# EAGLE design ArduinoInterface_v4.2 (EAGLE 9.2.1)
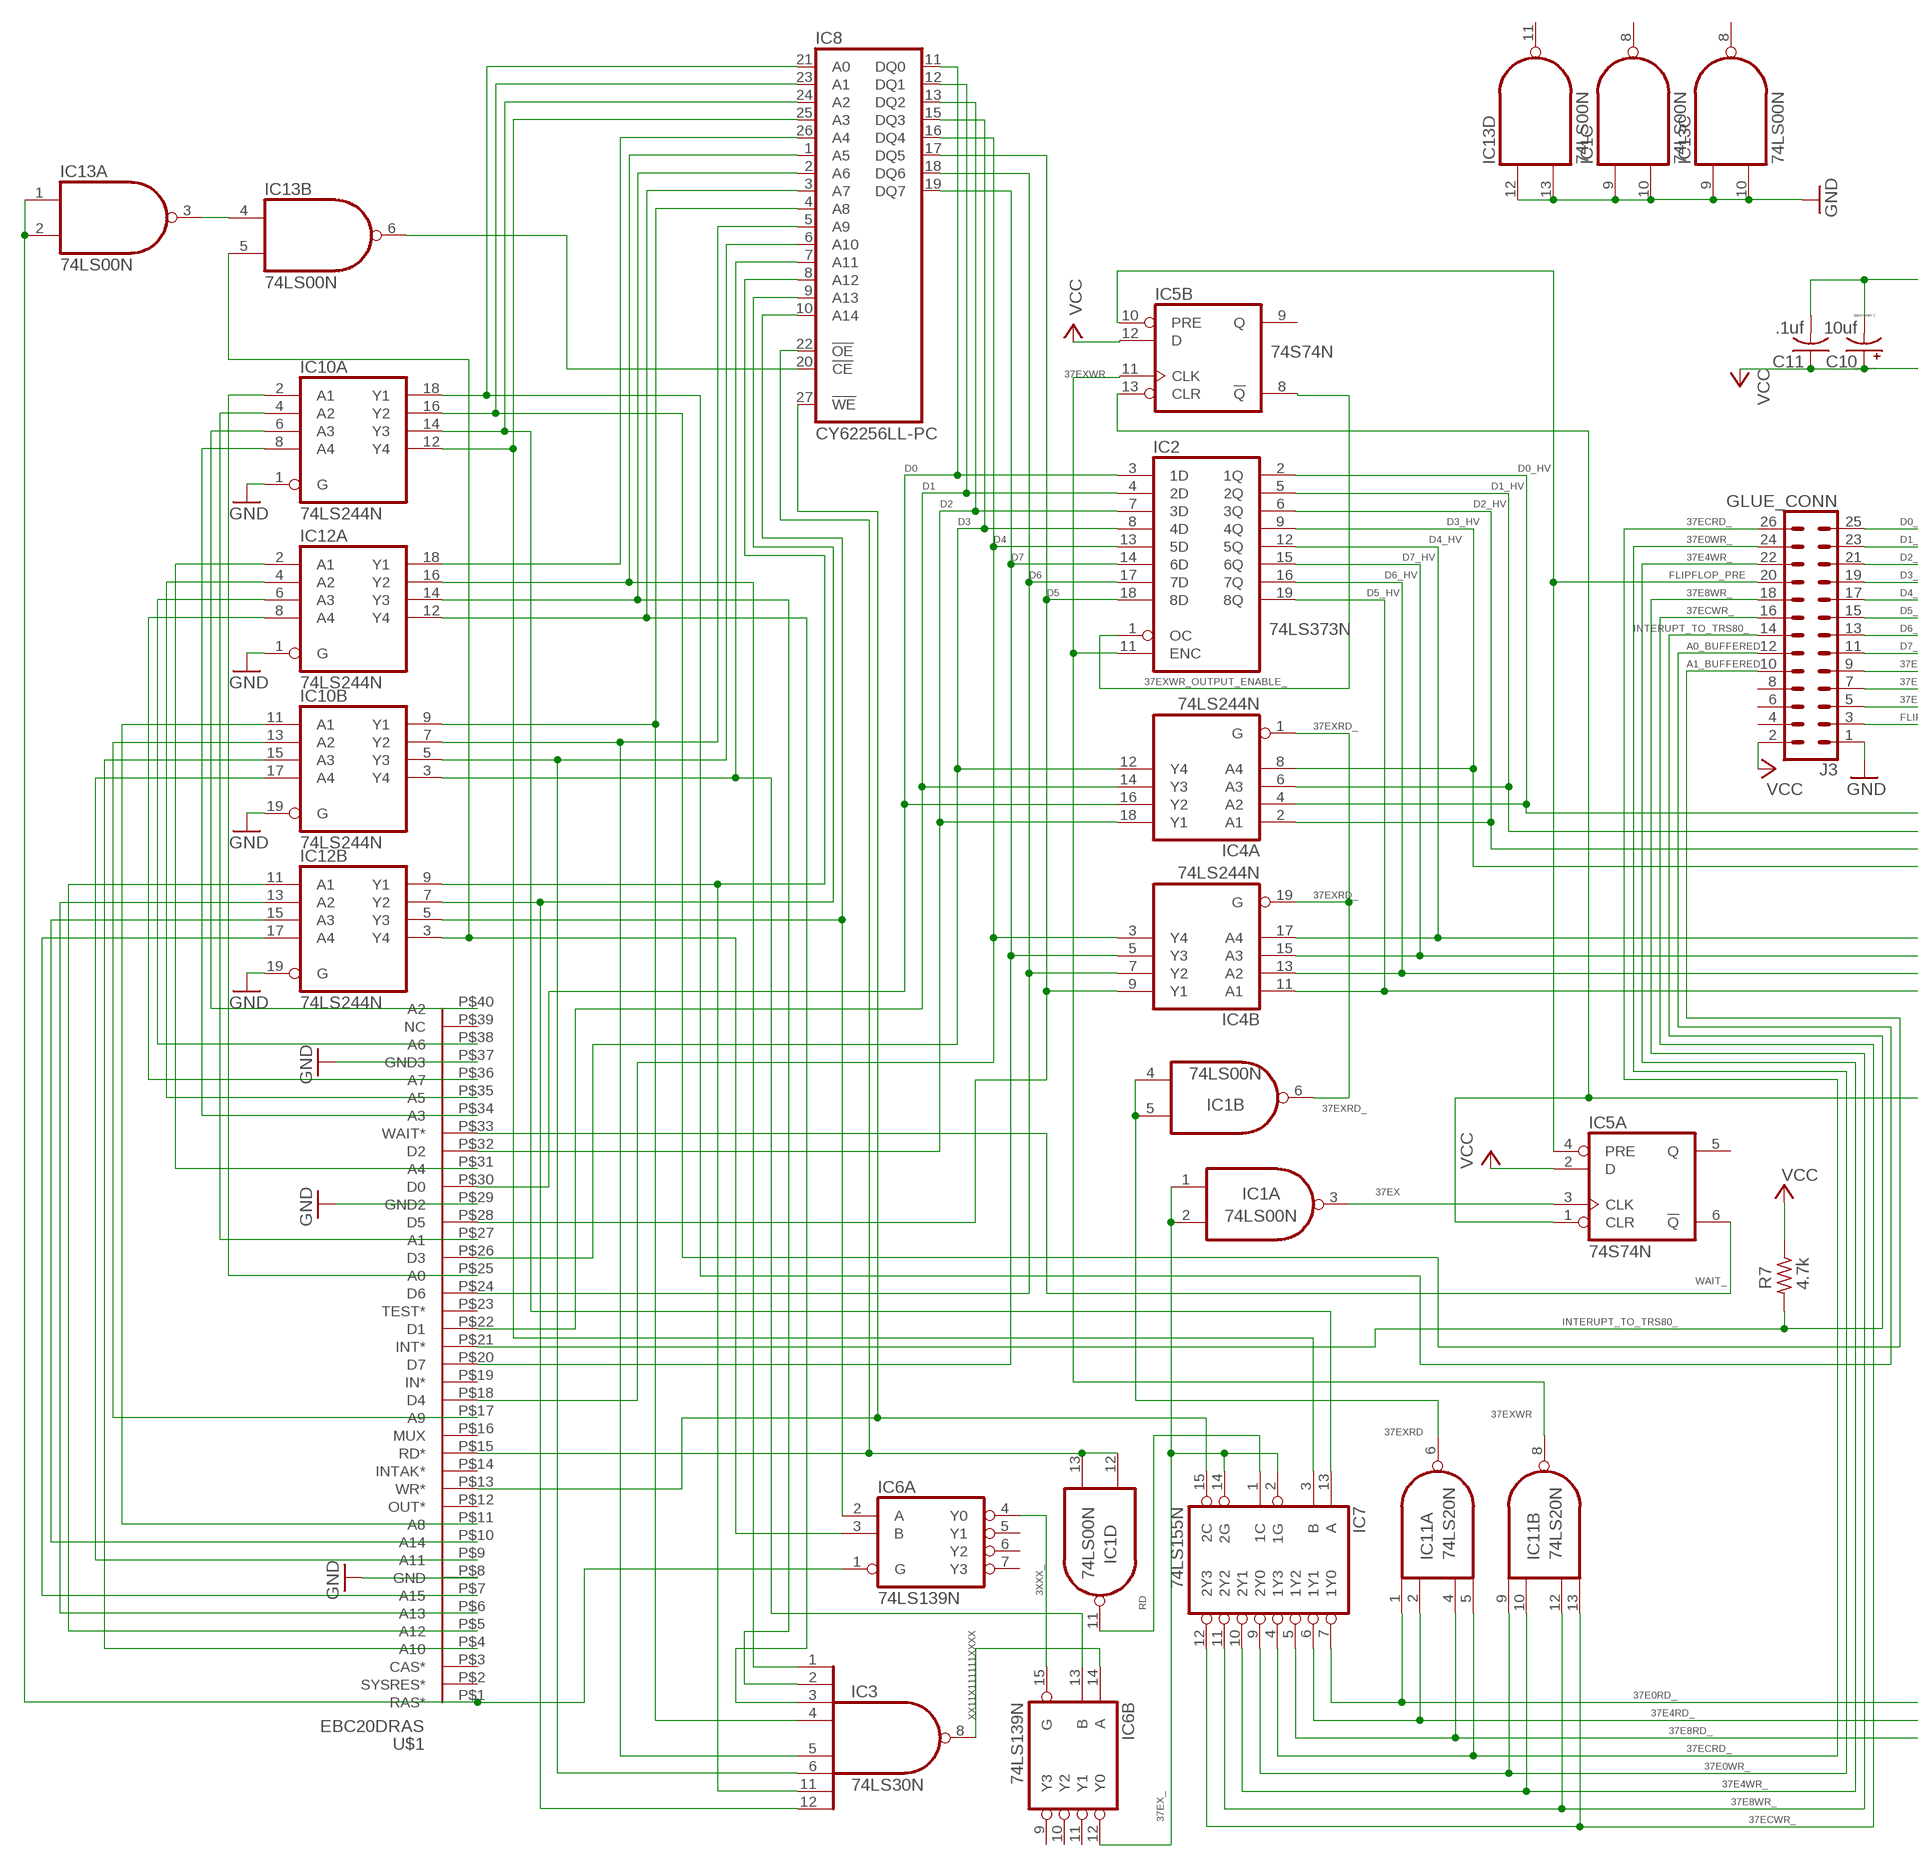
[diagram p0: schematic, sheet 1, part 1 of 2]
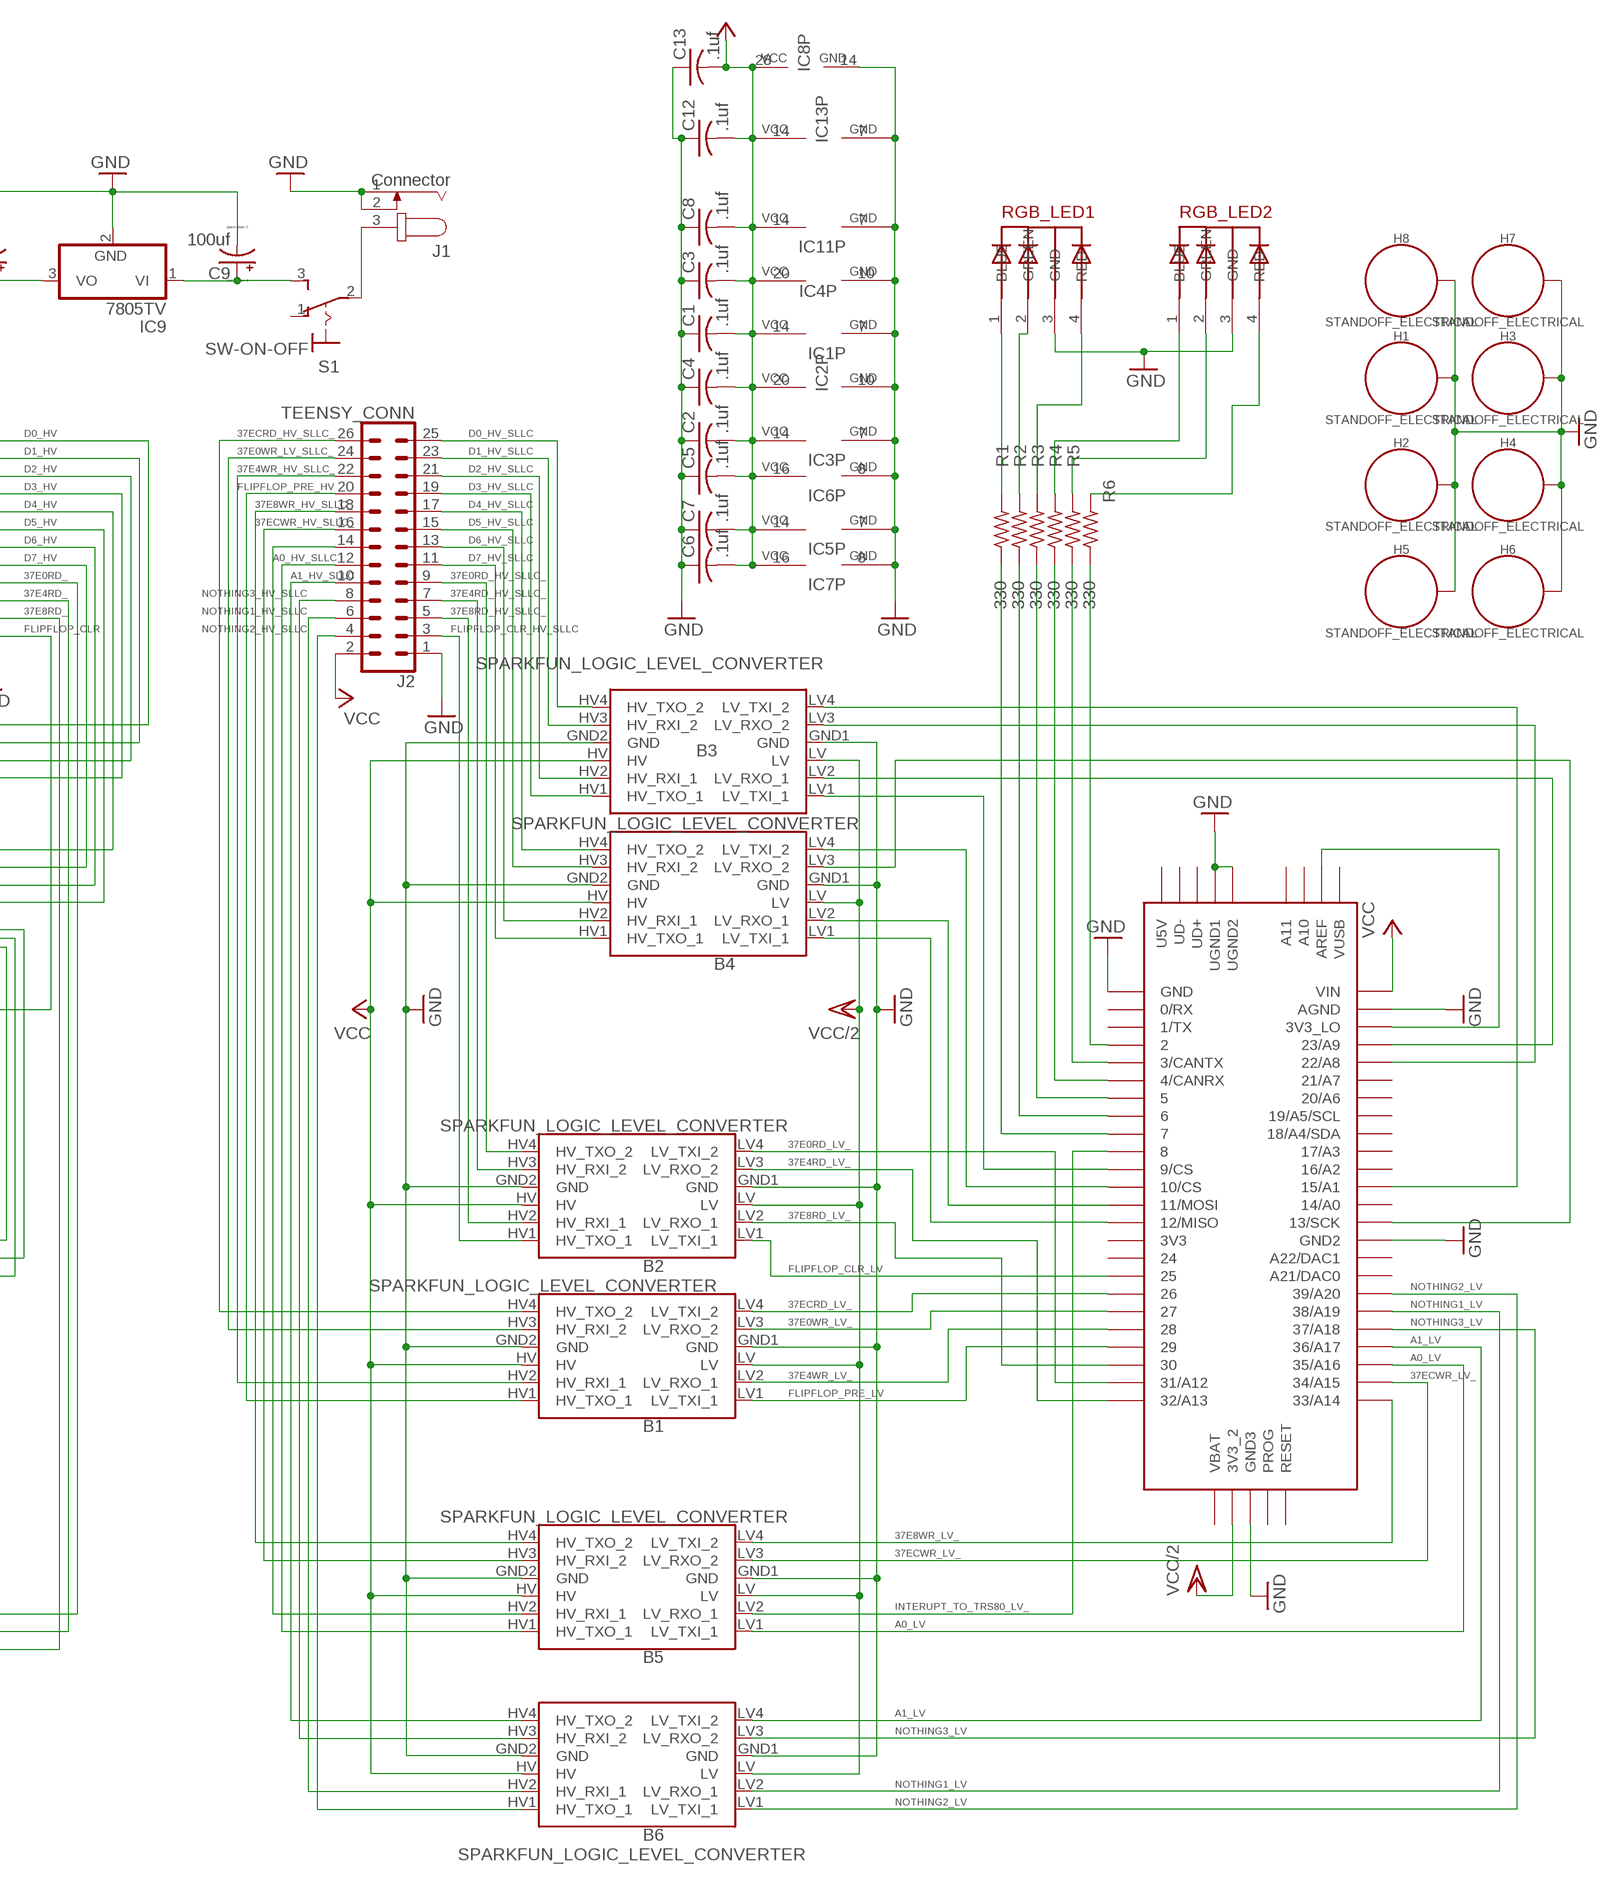
[diagram p1: schematic, sheet 1, part 2 of 2]

## Parts
B1  SPARKFUN_LOGIC_LEVEL_CONVERTER  [SPARKFUN_LOGIC_LEVEL_CONVERTER]
B2  SPARKFUN_LOGIC_LEVEL_CONVERTER  [SPARKFUN_LOGIC_LEVEL_CONVERTER]
B3  SPARKFUN_LOGIC_LEVEL_CONVERTER  [SPARKFUN_LOGIC_LEVEL_CONVERTER]
B4  SPARKFUN_LOGIC_LEVEL_CONVERTER  [SPARKFUN_LOGIC_LEVEL_CONVERTER]
B5  SPARKFUN_LOGIC_LEVEL_CONVERTER  [SPARKFUN_LOGIC_LEVEL_CONVERTER]
B6  SPARKFUN_LOGIC_LEVEL_CONVERTER  [SPARKFUN_LOGIC_LEVEL_CONVERTER]
C1  .1uf  C-US025-025X050  [C025-025X050]
C2  .1uf  C-US025-025X050  [C025-025X050]
C3  .1uf  C-US025-025X050  [C025-025X050]
C4  .1uf  C-US025-025X050  [C025-025X050]
C5  .1uf  C-US025-025X050  [C025-025X050]
C6  .1uf  C-US025-025X050  [C025-025X050]
C7  .1uf  C-US025-025X050  [C025-025X050]
C8  .1uf  C-US025-025X050  [C025-025X050]
C9  100uf  CPOL-USE5-6  [E5-6]
C10  10uf  CPOL-USE5-6  [E5-6]
C11  .1uf  C-US025-025X050  [C025-025X050]
C12  .1uf  C-US025-025X050  [C025-025X050]
C13  .1uf  C-US025-025X050  [C025-025X050]
H1  STANDOFF_ELECTRICAL  [STANDOFF-ELECTRICAL]
H2  STANDOFF_ELECTRICAL  [STANDOFF-ELECTRICAL]
H3  STANDOFF_ELECTRICAL  [STANDOFF-ELECTRICAL]
H4  STANDOFF_ELECTRICAL  [STANDOFF-ELECTRICAL]
H5  STANDOFF_ELECTRICAL  [STANDOFF-ELECTRICAL]
H6  STANDOFF_ELECTRICAL  [STANDOFF-ELECTRICAL]
H7  STANDOFF_ELECTRICAL  [STANDOFF-ELECTRICAL]
H8  STANDOFF_ELECTRICAL  [STANDOFF-ELECTRICAL]
IC1  74LS00N  [DIL14]
IC2  74LS373N  [DIL20]
IC3  74LS30N  [DIL14]
IC4  74LS244N  [DIL20]
IC5  74S74N  [DIL14]
IC6  74LS139N  [DIL16]
IC7  74LS155N  [DIL16]
IC8  CY62256LL-PC  [DIL28-6]
IC9  7805TV  [TO220V]
IC10  74LS244N  [DIL20]
IC11  74LS20N  [DIL14]
IC12  74LS244N  [DIL20]
IC13  74LS00N  [DIL14]
J1  Connector  JACK-PLUG0  [SPC4077]
J2  TEENSY_CONN  CONN_13X22X13  [2X13]
J3  GLUE_CONN  CONN_13X22X13  [2X13]
R1  330  R-US_0204/2V  [0204V]
R2  330  R-US_0204/2V  [0204V]
R3  330  R-US_0204/2V  [0204V]
R4  330  R-US_0204/2V  [0204V]
R5  330  R-US_0204/2V  [0204V]
R6  330  R-US_0204/2V  [0204V]
R7  4.7k  R-US_0204/2V  [0204V]
RGB_LED1  5MMRGBLED  [LED5MMRGB]
RGB_LED2  5MMRGBLED  [LED5MMRGB]
S1  SW-ON-OFF  M9040P  [M9040P]
U$1  EBC20DRAS  [EBC20DRAS]
U$2  TEENSY_3.5/3.6  [TEENSY_3.5/3.6]

## Nets
3XXX_: IC6.4(A:Y0) IC6.15(B:G)
9V: C9.+ IC9.1(VI) S1.3(S)
9V_TO_SW: J1.3 S1.2(P)
37E0RD_: IC7.7(1Y0) IC11.1(A:I0) J3.9
37E0RD_HV_SLLC_: B2.HV4(HV_TXO_2) J2.9
37E0RD_LV_: B2.LV4(LV_TXI_2) U$2.31/A12
37E0WR_: IC7.9(2Y0) IC11.9(B:I0) J3.24
37E0WR_LV_: B1.LV3(LV_RXO_2) U$2.27
37E0WR_LV_SLLC_: B1.HV3(HV_RXI_2) J2.24
37E4RD_: IC7.6(1Y1) IC11.2(A:I1) J3.7
37E4RD_HV_SLLC_: B2.HV3(HV_RXI_2) J2.7
37E4RD_LV_: B2.LV3(LV_RXO_2) U$2.32/A13
37E4WR_: IC7.10(2Y1) IC11.10(B:I1) J3.22
37E4WR_HV_SLLC_: B1.HV2(HV_RXI_1) J2.22
37E4WR_LV_: B1.LV2(LV_RXO_1) U$2.28
37E8RD_: IC7.5(1Y2) IC11.4(A:I2) J3.5
37E8RD_HV_SLLC_: B2.HV2(HV_RXI_1) J2.5
37E8RD_LV_: B2.LV2(LV_RXO_1) U$2.30
37E8WR_: IC7.11(2Y2) IC11.12(B:I2) J3.18
37E8WR_HV_SLLC_: B5.HV4(HV_TXO_2) J2.18
37E8WR_LV_: B5.LV4(LV_TXI_2) U$2.33/A14
37ECRD_: IC7.4(1Y3) IC11.5(A:I3) J3.26
37ECRD_HV_SLLC_: B1.HV4(HV_TXO_2) J2.26
37ECRD_LV_: B1.LV4(LV_TXI_2) U$2.26
37ECWR_: IC7.12(2Y3) IC11.13(B:I3) J3.16
37ECWR_HV_SLLC_: B5.HV3(HV_RXI_2) J2.16
37ECWR_LV_: B5.LV3(LV_RXO_2) U$2.34/A15
37EX: IC1.3(A:O) IC5.3(A:CLK)
37EX_: IC1.1(A:I0) IC1.2(A:I1) IC6.12(B:Y0) IC7.2(1G) IC7.14(2G)
37EXRD: IC1.4(B:I0) IC1.5(B:I1) IC11.6(A:O)
37EXRD_: IC1.6(B:O) IC4.1(A:G) IC4.19(B:G)
37EXWR: IC2.11(ENC) IC5.11(B:CLK) IC11.8(B:O)
37EXWR_OUTPUT_ENABLE_: IC2.1(OC) IC5.8(B:!Q)
A0_BUFFERED: IC8.21(A0) IC10.18(A:Y1) J3.12
A0_HV_SLLC: B5.HV1(HV_TXO_1) J2.12
A0_LV: B5.LV1(LV_TXI_1) U$2.35/A16
A0_RAW: IC10.2(A:A1) U$1.P$25(A0)
A1_BUFFERED: IC8.23(A1) IC10.16(A:Y2) J3.10
A1_HV_SLLC: B6.HV4(HV_TXO_2) J2.10
A1_LV: B6.LV4(LV_TXI_2) U$2.36/A17
A1_RAW: IC10.4(A:A2) U$1.P$27(A1)
A2_BUFFERED: IC7.13(A) IC8.24(A2) IC10.14(A:Y3)
A2_RAW: IC10.6(A:A3) U$1.P$40(A2)
A3_BUFFERED: IC7.3(B) IC8.25(A3) IC10.12(A:Y4)
A3_RAW: IC10.8(A:A4) U$1.P$34(A3)
A4_RAW: IC12.2(A:A1) U$1.P$31(A4)
A5_BUFFERED: IC3.1(I0) IC8.1(A5) IC12.16(A:Y2)
A5_RAW: IC12.4(A:A2) U$1.P$35(A5)
A6_BUFFERED: IC3.2(I1) IC8.2(A6) IC12.14(A:Y3)
A6_RAW: IC12.6(A:A3) U$1.P$38(A6)
A7_BUFFERED: IC3.3(I2) IC8.3(A7) IC12.12(A:Y4)
A7_RAW: IC12.8(A:A4) U$1.P$36(A7)
A8_BUFFERED: IC3.4(I3) IC8.4(A8) IC10.9(B:Y1)
A8_RAW: IC10.11(B:A1) U$1.P$11(A8)
A9_BUFFERED: IC3.5(I4) IC8.5(A9) IC10.7(B:Y2)
A9_RAW: IC10.13(B:A2) U$1.P$17(A9)
A10_BUFFERED: IC3.6(I5) IC8.6(A10) IC10.5(B:Y3)
A10_RAW: IC10.15(B:A3) U$1.P$4(A10)
A11_BUFFERED: IC6.13(B:B) IC8.7(A11) IC10.3(B:Y4)
A11_RAW: IC10.17(B:A4) U$1.P$9(A11)
A12_BUFFERED: IC3.11(I6) IC8.8(A12) IC12.9(B:Y1)
A12_RAW: IC12.11(B:A1) U$1.P$5(A12)
A13_BUFFERED: IC3.12(I7) IC8.9(A13) IC12.7(B:Y2)
A13_RAW: IC12.13(B:A2) U$1.P$6(A13)
A14_BUFFERED: IC6.2(A:A) IC8.10(A14) IC12.5(B:Y3)
A14_RAW: IC12.15(B:A3) U$1.P$10(A14)
A15_BUFFERED: IC6.3(A:B) IC12.3(B:Y4) IC13.5(B:I1)
A15_RAW: IC12.17(B:A4) U$1.P$7(A15)
D0: IC2.3(1D) IC4.16(A:Y2) IC8.11(DQ0) U$1.P$30(D0)
D0_HV: IC2.2(1Q) IC4.4(A:A2) J3.25
D0_HV_SLLC: B3.HV4(HV_TXO_2) J2.25
D0_LV: B3.LV4(LV_TXI_2) U$2.15/A1
D1: IC2.4(2D) IC4.14(A:Y3) IC8.12(DQ1) U$1.P$22(D1)
D1_HV: IC2.5(2Q) IC4.6(A:A3) J3.23
D1_HV_SLLC: B3.HV3(HV_RXI_2) J2.23
D1_LV: B3.LV3(LV_RXO_2) U$2.22/A8
D2: IC2.7(3D) IC4.18(A:Y1) IC8.13(DQ2) U$1.P$32(D2)
D2_HV: IC2.6(3Q) IC4.2(A:A1) J3.21
D2_HV_SLLC: B3.HV2(HV_RXI_1) J2.21
D2_LV: B3.LV2(LV_RXO_1) U$2.23/A9
D3: IC2.8(4D) IC4.12(A:Y4) IC8.15(DQ3) U$1.P$26(D3)
D3_HV: IC2.9(4Q) IC4.8(A:A4) J3.19
D3_HV_SLLC: B3.HV1(HV_TXO_1) J2.19
D3_LV: B3.LV1(LV_TXI_1) U$2.9/CS
D4: IC2.13(5D) IC4.3(B:Y4) IC8.16(DQ4) U$1.P$18(D4)
D4_HV: IC2.12(5Q) IC4.17(B:A4) J3.17
D4_HV_SLLC: B4.HV4(HV_TXO_2) J2.17
D4_LV: B4.LV4(LV_TXI_2) U$2.10/CS
D5: IC2.18(8D) IC4.9(B:Y1) IC8.17(DQ5) U$1.P$28(D5)
D5_HV: IC2.19(8Q) IC4.11(B:A1) J3.15
D5_HV_SLLC: B4.HV3(HV_RXI_2) J2.15
D5_LV: B4.LV3(LV_RXO_2) U$2.13/SCK
D6: IC2.17(7D) IC4.7(B:Y2) IC8.18(DQ6) U$1.P$24(D6)
D6_HV: IC2.16(7Q) IC4.13(B:A2) J3.13
D6_HV_SLLC: B4.HV2(HV_RXI_1) J2.13
D6_LV: B4.LV2(LV_RXO_1) U$2.11/MOSI
D7: IC2.14(6D) IC4.5(B:Y3) IC8.19(DQ7) U$1.P$20(D7)
D7_HV: IC2.15(6Q) IC4.15(B:A3) J3.11
D7_HV_SLLC: B4.HV1(HV_TXO_1) J2.11
D7_LV: B4.LV1(LV_TXI_1) U$2.12/MISO
FLIPFLOP_CLR: IC5.1(A:CLR) IC5.13(B:CLR) J3.3
FLIPFLOP_CLR_HV_SLLC: B2.HV1(HV_TXO_1) J2.3
FLIPFLOP_CLR_LV: B2.LV1(LV_TXI_1) U$2.25
FLIPFLOP_PRE: IC5.4(A:PRE) IC5.10(B:PRE) J3.20
FLIPFLOP_PRE_HV: B1.HV1(HV_TXO_1) J2.20
FLIPFLOP_PRE_LV: B1.LV1(LV_TXI_1) U$2.29
GND: B1.GND1(GND) B1.GND2(GND) B2.GND1(GND) B2.GND2(GND) B3.GND1(GND) B3.GND2(GND) B4.GND1(GND) B4.GND2(GND) B5.GND1(GND) B5.GND2(GND) B6.GND1(GND) B6.GND2(GND) C1.1 C2.1 C3.1 C4.1 C5.1 C6.1 C7.1 C8.1 C9.- C10.- C11.2 C12.1 C13.1 H1.P1 H2.P1 H3.P1 H4.P1 H5.P1 H6.P1 H7.P1 H8.P1 IC1.7(P:GND) IC1.9(C:I0) IC1.10(C:I1) IC2.10(GND) IC3.7(GND) IC4.10(P:GND) IC5.7(P:GND) IC6.8(P:GND) IC7.8(GND) IC8.14(GND) IC9.2(GND) IC10.1(A:G) IC10.19(B:G) IC11.7(P:GND) IC12.1(A:G) IC12.19(B:G) IC13.7(P:GND) IC13.9(C:I0) IC13.10(C:I1) IC13.12(D:I0) IC13.13(D:I1) J1.1 J1.2 J2.1 J3.1 RGB_LED1.3(GND) RGB_LED2.3(GND) U$1.P$8(GND) U$1.P$29(GND2) U$1.P$37(GND3) U$2.AGND U$2.GND U$2.GND2 U$2.GND3 U$2.UGND1 U$2.UGND2
INTERUPT_TO_TRS80_: J3.14 R7.2 U$1.P$21(INT*)
INTERUPT_TO_TRS80_HV_SLLC_: B5.HV2(HV_RXI_1) J2.14
INTERUPT_TO_TRS80_LV_: B5.LV2(LV_RXO_1) U$2.8
N$1: U$2.3V3_LO U$2.AREF
N$2: R2.2 RGB_LED1.2(GREEN)
N$3: R6.1 U$2.2
N$4: R5.1 U$2.3/CANTX
N$5: R4.1 U$2.4/CANRX
N$6: R3.1 U$2.5
N$7: R2.1 U$2.6
N$8: R1.1 U$2.7
N$9: IC8.26(A4) IC12.18(A:Y1)
N$10: R1.2 RGB_LED1.1(BLUE)
N$11: IC8.20(!CE) IC13.6(B:O)
N$15: R3.2 RGB_LED1.4(RED)
N$19: R4.2 RGB_LED2.1(BLUE)
N$20: R5.2 RGB_LED2.2(GREEN)
N$21: R6.2 RGB_LED2.4(RED)
NOTHING1_HV_SLLC: B6.HV2(HV_RXI_1) J2.6
NOTHING1_LV: B6.LV2(LV_RXO_1) U$2.38/A19
NOTHING2_HV_SLLC: B6.HV1(HV_TXO_1) J2.4
NOTHING2_LV: B6.LV1(LV_TXI_1) U$2.39/A20
NOTHING3_HV_SLLC: B6.HV3(HV_RXI_2) J2.8
NOTHING3_LV: B6.LV3(LV_RXO_2) U$2.37/A18
RAS: IC13.3(A:O) IC13.4(B:I0)
RAS_: IC6.1(A:G) IC13.1(A:I0) IC13.2(A:I1) U$1.P$1(RAS*)
RD: IC1.11(D:O) IC7.1(1C)
RD_: IC1.12(D:I0) IC1.13(D:I1) IC8.22(!OE) U$1.P$15(RD*)
VCC: B1.HV B2.HV B3.HV B4.HV B5.HV B6.HV C1.2 C2.2 C3.2 C4.2 C5.2 C6.2 C7.2 C8.2 C10.+ C11.1 C12.2 C13.2 IC1.14(P:VCC) IC2.20(VCC) IC3.14(VCC) IC4.20(P:VCC) IC5.2(A:D) IC5.12(B:D) IC5.14(P:VCC) IC6.16(P:VCC) IC7.16(VCC) IC8.28(VCC) IC9.3(VO) IC11.14(P:VCC) IC13.14(P:VCC) J2.2 J3.2 R7.1 U$2.VIN
VCC/2: B1.LV B2.LV B3.LV B4.LV B5.LV B6.LV U$2.3V3_2
WAIT_: IC5.6(A:!Q) U$1.P$33(WAIT*)
WR_: IC7.15(2C) IC8.27(!WE) U$1.P$13(WR*)
XX11X111111XXXX: IC3.8(O) IC6.14(B:A)
Unconnected: IC1.8(C:O) IC5.5(A:Q) IC5.9(B:Q) IC6.5(A:Y1) IC6.6(A:Y2) IC6.7(A:Y3) IC6.9(B:Y3) IC6.10(B:Y2) IC6.11(B:Y1) IC13.8(C:O) IC13.11(D:O) J3.4 J3.6 J3.8 S1.1(O) U$1.P$2(SYSRES*) U$1.P$3(CAS*) U$1.P$12(OUT*) U$1.P$14(INTAK*) U$1.P$16(MUX) U$1.P$19(IN*) U$1.P$23(TEST*) U$1.P$39(NC) U$2.0/RX U$2.1/TX U$2.3V3 U$2.14/A0 U$2.16/A2 U$2.17/A3 U$2.18/A4/SDA U$2.19/A5/SCL U$2.20/A6 U$2.21/A7 U$2.21/DAC0(A21/DAC0) U$2.24 U$2.A10 U$2.A11 U$2.A22/DAC1 U$2.PROG U$2.RESET U$2.U5V U$2.UD+ U$2.UD- U$2.VBAT U$2.VUSB

## Power pins joined to a net without a drawn wire
GND: IC10.10(P:GND) IC12.10(P:GND)
VCC: IC10.20(P:VCC) IC12.20(P:VCC)

## Library data of the parts
B1-B6 = SparkFun-Boards:SPARKFUN_LOGIC_LEVEL_CONVERTER: SparkFun Logic Level Converter -Bi-Directional This is the mechnical outline for the 3.3V - 5V bi directional logic level converter. *Note, the "LOCK" Package has the header pins staggered by an offset of 5 mils (off center line), so that when you slide a row of standard 0.1" headers into the PTH pads, it will hold position vertically. See the follwing turorial for more information on this type of special footprints: Sneaky Footprints <https://www.sparkfun.com/tutorials/114> SparkFun Products: SparkFun Logic Level Converter - Bi-Directional <https://www.sparkfun.com/products/12009>
C1-C8 C11-C13 = adafruit:C-US: CAPACITOR, American symbol
C9 C10 = resistor:CPOL-US: POLARIZED CAPACITOR, American symbol
H1-H8 = SparkFun-Hardware:STANDOFF_ELECTRICAL: Stand Off Drill holes with an electrical connection. For example, use these to ground your board to a chassis. Example SparkFun Products Screw - Phillips Head (1/4", 4-40, 10 pack) <https://www.sparkfun.com/products/10453> (PRT-10453) Screw - Phillips Head (1/2", 4-40, 10 pack) <https://www.sparkfun.com/products/10452> (PRT-10452) Screw - Phillips Head (3/4", 4-40, 10 pack) <https://www.sparkfun.com/products/10451> (PRT-10451) Screw - Phillips Head (1", 4-40, 10 pack) <https://www.sparkfun.com/products/10450> (PRT-10450)
IC1 IC13 = 74xx-us:74*00: Quad 2-input NAND gate
IC2 = 74xx-us:74*373: Octal D type transparent LATCH, edge triggered
IC3 = 74xx-us:74*30: 8-input NAND gate
IC4 IC10 IC12 = 74xx-us:74*244: Octal BUFFER and LINE DRIVER, 3-state
IC5 = 74xx-us:74*74: Dual D type positive edge triggered FLIP FLOP, preset and clear
IC6 = 74xx-us:74*139: Dual 2-line to 4-line DECODER/DEMULTIPLEXER
IC7 = 74xx-us:74*155: Dual 2-line to 4-line data DECODER/DEMULTIPLEXER
IC8 = memory-sram:CY62256LL-?*: 256K (32K x 8) CMOS-Static RAM Source: http://download.cypress.com.edgesuite.net/design_resources/datasheets/contents/cy62256_8.pdf
IC9 = linear:78*: Positive VOLTAGE REGULATOR Source: http://cache.national.com/ds/LM/LM78L05.pdf http://www.fairchildsemi.com/ds/LM/LM7805.pdf
IC11 = 74xx-us:74*20: Dual 4-input NAND gate
J1 = con-jack:JACK-PLUG: DC POWER JACK Power Jack, DC, Right Angle, Through Hole, Rated 5A at 16VDC, PC Terminals Distributor: Farnell (www.Farnell.de) Drawing: 84N1161.pdf / 84N1162.pdf Manufacturer: SPC Technology (www.spctechnology.com) Type: SPC4077 / SPC 4078; OC_FARNELL: unknown; OC_NEWARK: unknown
J2 J3 = SparkFun-Connectors:CONN_13X2: Multi connection point. Often used as Generic Header-pin footprint for 0.1 inch spaced/style header connections On any of the 0.1 inch spaced packages, you can populate with these: Break Away Headers - Straight <https://www.sparkfun.com/products/116> (PRT-00116) Break Away Male Headers - Right Angle <https://www.sparkfun.com/products/553> (PRT-00553) Female Headers <https://www.sparkfun.com/products/115> (PRT-00115) Break Away Headers - Machine Pin <https://www.sparkfun.com/products/117> (PRT-00117) Break Away Female Headers - Swiss Machine Pin <https://www.sparkfun.com/products/743> (PRT-00743)
R1-R7 = resistor:R-US_: RESISTOR, American symbol
RGB_LED1 RGB_LED2 = adafruit:5MMRGBLED
S1 = switch:M9040P: TOGGLE SWITCH Marquardt
U$1 = TMS99:EBC20DRAS
U$2 = Teensy356:TEENSY_3.5/3.6

## Net classes
0 default: width 0.3 mm, clearance 0.05 mm

## Board
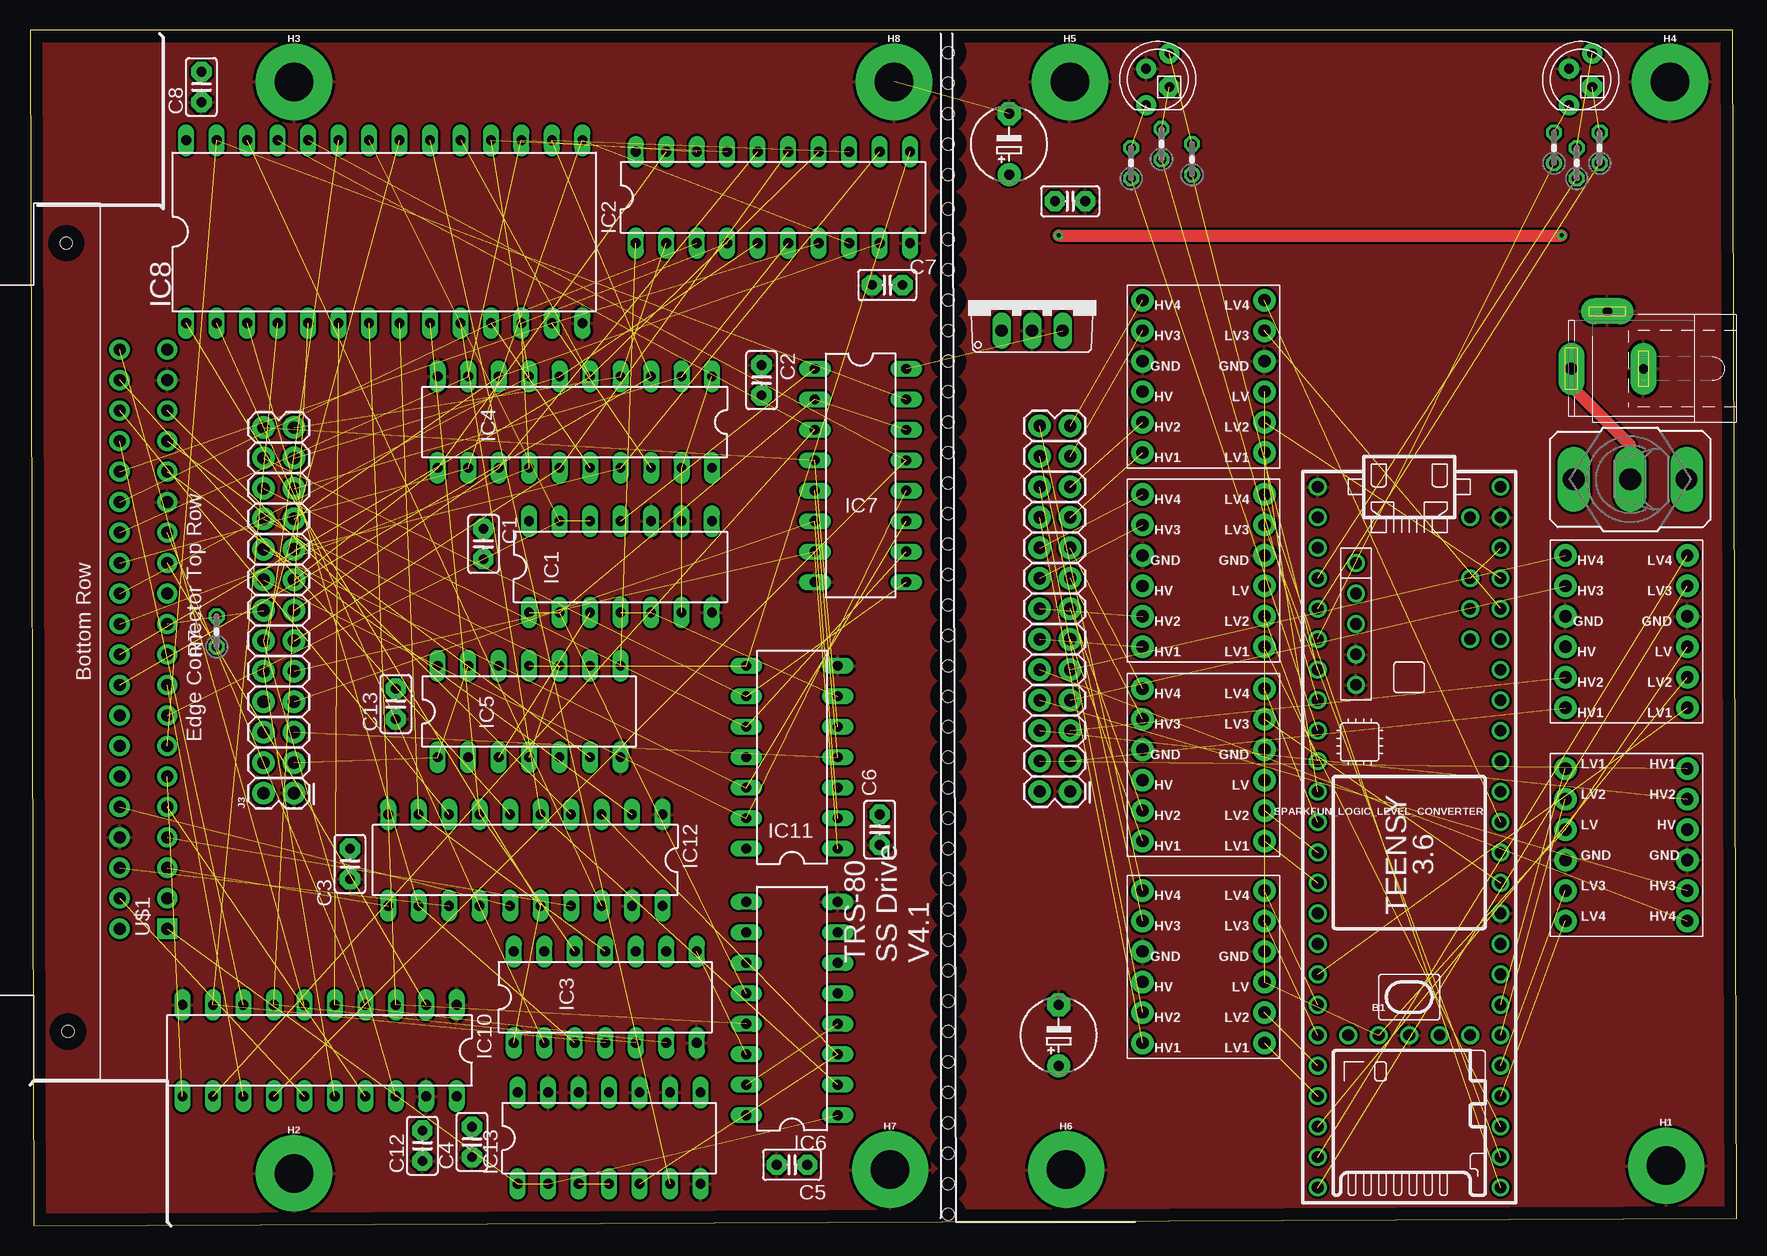
[diagram p2: board, top side]
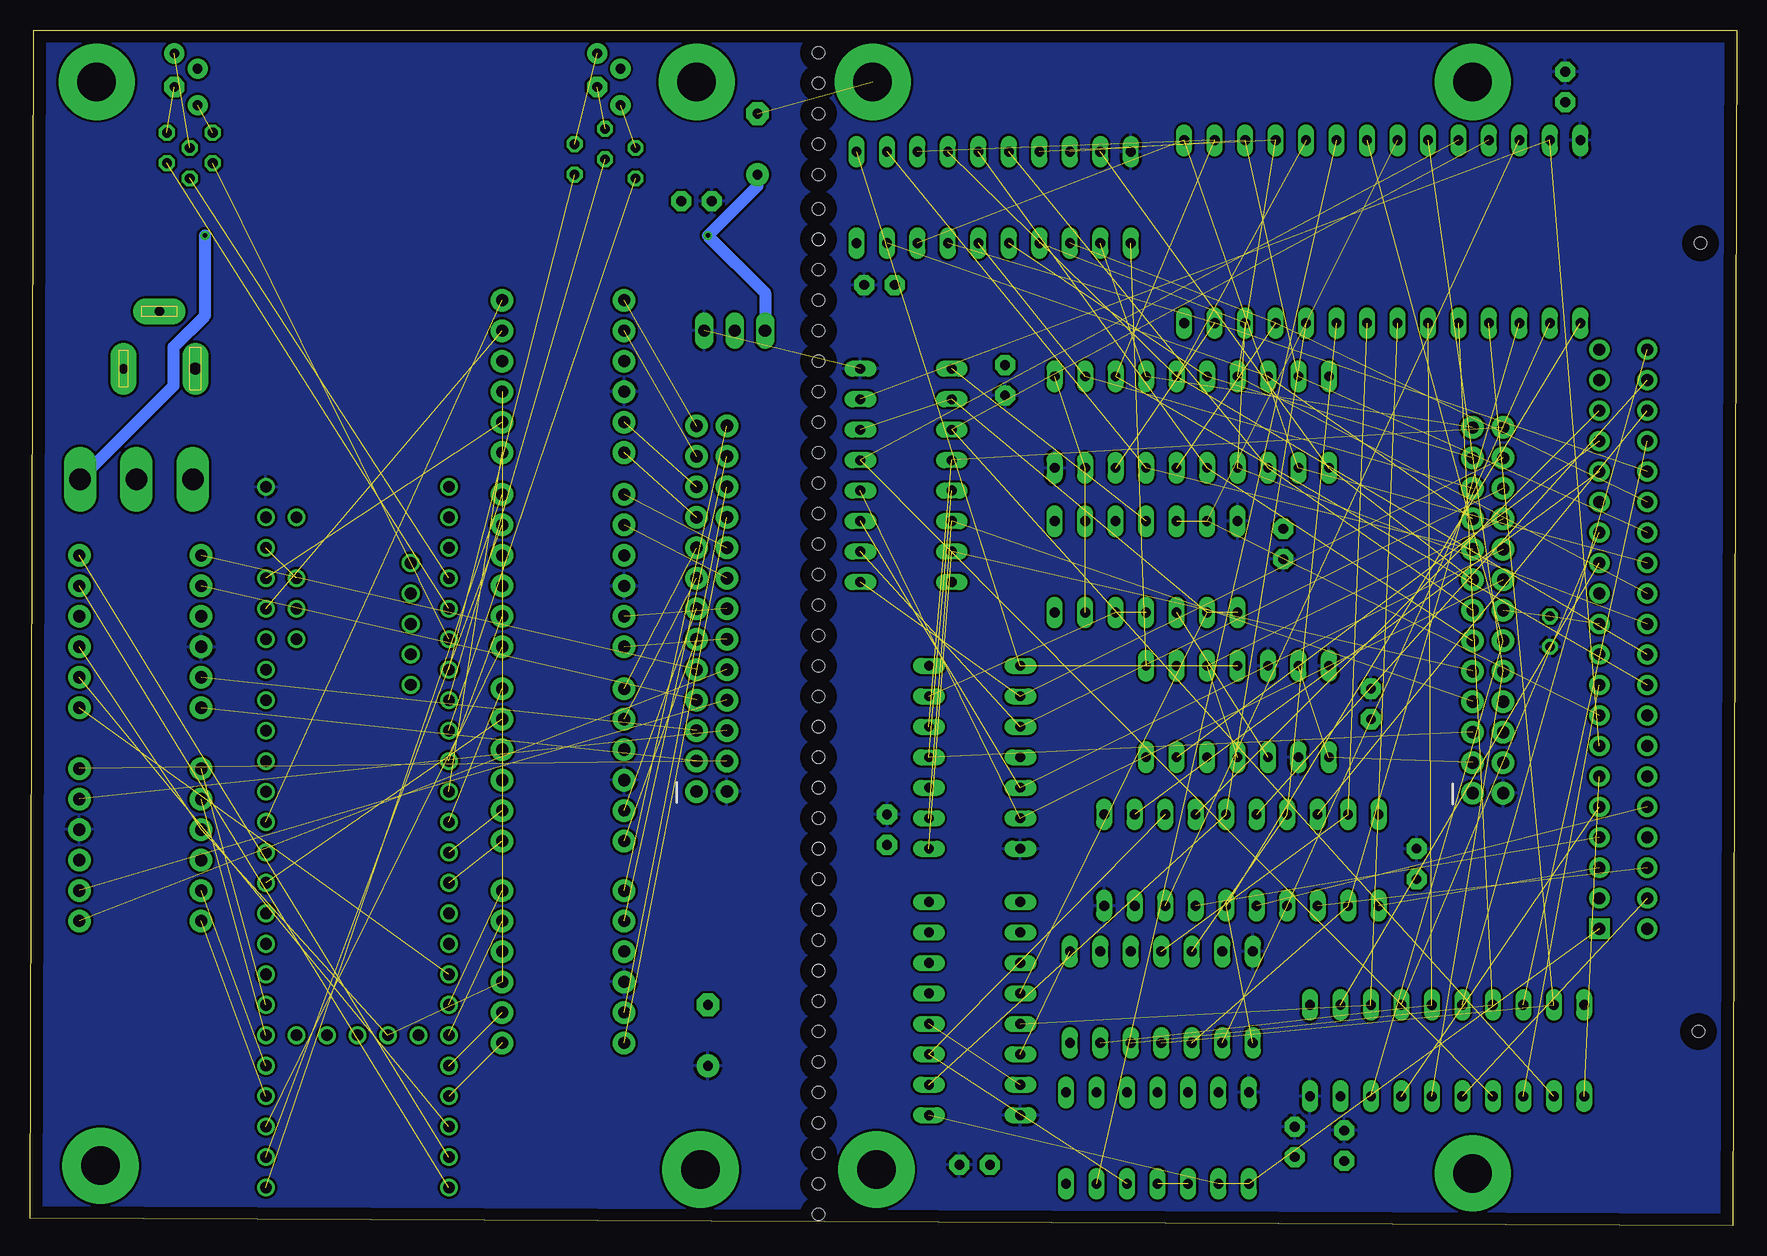
[diagram p3: board, bottom side, seen from below]

Size 142.22 x 99.68 mm. Coordinates in mm from the lower left corner, seen from the top.
Outline: 0.32,0 142.22,0.63 141.9,99.68 0,99.68 0.32,0
Copper layers (1*16): Top 0.035mm / dielectric 1.5mm / Bottom 0.035mm
Design rules "default": minimum track width 0.2mm, minimum drill 0.35mm, track to track 8mil, track to pad 8mil, pad to pad 8mil, via to via 8mil, smd to smd 8mil, copper to edge 40mil, drill to drill 6mil, minimum pad ring 10mil, minimum via ring 8mil, stop-mask expansion 4mil, vias tented up to drill 0mil, thermal gap 10mil
Holes 1 mm at 76.52,84.77 76.52,79.69 76.52,74.61 76.52,69.53 76.52,64.45 76.52,61.91 76.52,59.37 76.52,54.29 76.52,51.75 76.52,44.13 76.52,41.59 76.52,39.05 76.52,33.97 76.52,31.43 76.52,28.89 76.52,23.81 76.52,18.73 76.52,13.65 76.52,56.83 76.52,66.99 76.52,49.21 76.52,21.27 76.52,77.15 76.52,36.51 76.52,87.63 76.52,90.17 76.52,92.71 76.52,11.11 76.52,8.57 76.52,6.03 76.52,3.49 76.52,95.25 76.52,97.79 76.52,82.23 76.52,72.07 76.52,46.67 76.52,26.35 76.52,16.19 76.52,0.95

### Footprints (pad centres in the part's own frame; a part is rotated, then mirrored left to right if it is on the bottom)
SPARKFUN_LOGIC_LEVEL_CONVERTER = drill 1.016 pad 1.88: GND1 -5.08,-1.27; GND2 5.08,-1.27; HV 5.08,1.27; HV1 5.08,6.35; HV2 5.08,3.81; HV3 5.08,-3.81; HV4 5.08,-6.35; LV -5.08,1.27; LV1 -5.08,6.35; LV2 -5.08,3.81; LV3 -5.08,-3.81; LV4 -5.08,-6.35
C025-025X050 = drill 0.813 pad 1.676 octagon: 1 -1.27,0; 2 1.27,0
E5-6 = drill 0.813 pad 1.905: + -2.54,0 | drill 0.813 pad 1.905 octagon: - 2.54,0
STANDOFF-ELECTRICAL = drill 3.2 pad 6.35: P1 0,0
DIL14 = drill 0.813 long: 1 -7.62,-3.81; 2 -5.08,-3.81; 3 -2.54,-3.81; 4 0,-3.81; 5 2.54,-3.81; 6 5.08,-3.81; 7 7.62,-3.81; 8 7.62,3.81; 9 5.08,3.81; 10 2.54,3.81; 11 0,3.81; 12 -2.54,3.81; 13 -5.08,3.81; 14 -7.62,3.81
DIL20 = drill 0.813 long: 1 -11.43,-3.81; 2 -8.89,-3.81; 3 -6.35,-3.81; 4 -3.81,-3.81; 5 -1.27,-3.81; 6 1.27,-3.81; 7 3.81,-3.81; 8 6.35,-3.81; 9 8.89,-3.81; 10 11.43,-3.81; 11 11.43,3.81; 12 8.89,3.81; 13 6.35,3.81; 14 3.81,3.81; 15 1.27,3.81; 16 -1.27,3.81; 17 -3.81,3.81; 18 -6.35,3.81; 19 -8.89,3.81; 20 -11.43,3.81
DIL16 = drill 0.813 long: 1 -8.89,-3.81; 2 -6.35,-3.81; 3 -3.81,-3.81; 4 -1.27,-3.81; 5 1.27,-3.81; 6 3.81,-3.81; 7 6.35,-3.81; 8 8.89,-3.81; 9 8.89,3.81; 10 6.35,3.81; 11 3.81,3.81; 12 1.27,3.81; 13 -1.27,3.81; 14 -3.81,3.81; 15 -6.35,3.81; 16 -8.89,3.81
DIL28-6 = drill 0.813 long: 1 -16.51,-7.62; 2 -13.97,-7.62; 3 -11.43,-7.62; 4 -8.89,-7.62; 5 -6.35,-7.62; 6 -3.81,-7.62; 7 -1.27,-7.62; 8 1.27,-7.62; 9 3.81,-7.62; 10 6.35,-7.62; 11 8.89,-7.62; 12 11.43,-7.62; 13 13.97,-7.62; 14 16.51,-7.62; 15 16.51,7.62; 16 13.97,7.62; 17 11.43,7.62; 18 8.89,7.62; 19 6.35,7.62; 20 3.81,7.62; 21 1.27,7.62; 22 -1.27,7.62; 23 -3.81,7.62; 24 -6.35,7.62; 25 -8.89,7.62; 26 -11.43,7.62; 27 -13.97,7.62; 28 -16.51,7.62
TO220V = drill 1.016 long: 1 -2.54,-2.54; 2 0,-2.54; 3 2.54,-2.54
SPC4077 = drill 0.8 pad 2.184 long: 1 -3,0; 2 0,-4.8 | drill 1 pad 2.184 long: 3 3,0
2X13 = drill 1.016 pad 1.88: 1 0,0; 2 0,2.54; 3 2.54,0; 4 2.54,2.54; 5 5.08,0; 6 5.08,2.54; 7 7.62,0; 8 7.62,2.54; 9 10.16,0; 10 10.16,2.54; 11 12.7,0; 12 12.7,2.54; 13 15.24,0; 14 15.24,2.54; 15 17.78,0; 16 17.78,2.54; 17 20.32,0; 18 20.32,2.54; 19 22.86,0; 20 22.86,2.54; 21 25.4,0; 22 25.4,2.54; 23 27.94,0; 24 27.94,2.54; 25 30.48,0; 26 30.48,2.54
0204V = drill 0.813 octagon: 1 -1.27,0; 2 1.27,0
LED5MMRGB = drill 0.8 pad 1.676: 1 -2.159,0.968; 3 0.889,0.968; 4 2.159,-0.968 | drill 0.8 pad 1.676 octagon: 2 -0.635,-0.968
M9040P = drill 1.803 long: 1 0,4.699; 2 0,0; 3 0,-4.699
EBC20DRAS = drill 1 pad 1.676 square: P$1 0,0 | drill 1 pad 1.676: P$2 0,3.969; P$3 2.54,0; P$4 2.54,3.969; P$5 5.08,0; P$6 5.08,3.969; P$7 7.62,0; P$8 7.62,3.969; P$9 10.16,0; P$10 10.16,3.969; P$11 12.7,0; P$12 12.7,3.969; P$13 15.24,0; P$14 15.24,3.969; P$15 17.78,0; P$16 17.78,3.969; P$17 20.32,0; P$18 20.32,3.969; P$19 22.86,0; P$20 22.86,3.969; P$21 25.4,0; P$22 25.4,3.969; P$23 27.94,0; P$24 27.94,3.969; P$25 30.48,0; P$26 30.48,3.969; P$27 33.02,0; P$28 33.02,3.969; P$29 35.56,0; P$30 35.56,3.969; P$31 38.1,0; P$32 38.1,3.969; P$33 40.64,0; P$34 40.64,3.969; P$35 43.18,0; P$36 43.18,3.969; P$37 45.72,0; P$38 45.72,3.969; P$39 48.26,0; P$40 48.26,3.969 | hole 1: -8.572,8.255; 57.15,8.414
TEENSY_3.5/3.6 = drill 0.965: 0/RX -25.4,-7.62; 1/TX -22.86,-7.62; 2 -20.32,-7.62; 3/CANTX -17.78,-7.62; 3V3 7.62,-7.62; 3V3_2 17.78,-2.54; 3V3_LO -22.86,7.62; 4/CANRX -15.24,-7.62; 5 -12.7,-7.62; 6 -10.16,-7.62; 7 -7.62,-7.62; 8 -5.08,-7.62; 9/CS -2.54,-7.62; 10/CS 0,-7.62; 11/MOSI 2.54,-7.62; 12/MISO 5.08,-7.62; 13/SCK 5.08,7.62; 14/A0 2.54,7.62; 15/A1 0,7.62; 16/A2 -2.54,7.62; 17/A3 -5.08,7.62; 18/A4/SDA -7.62,7.62; 19/A5/SCL -10.16,7.62; 20/A6 -12.7,7.62; 21/A7 -15.24,7.62; 21/DAC0 12.7,7.62; 22/A8 -17.78,7.62; 23/A9 -20.32,7.62; 24 10.16,-7.62; 25 12.7,-7.62; 26 15.24,-7.62; 27 17.78,-7.62; 28 20.32,-7.62; 29 22.86,-7.62; 30 25.4,-7.62; 31/A12 27.94,-7.62; 32/A13 30.48,-7.62; 33/A14 30.48,7.62; 34/A15 27.94,7.62; 35/A16 25.4,7.62; 36/A17 22.86,7.62; 37/A18 20.32,7.62; 38/A19 17.78,7.62; 39/A20 15.24,7.62; A10 -17.78,5.08; A11 -15.24,5.08; A22/DAC1 10.16,7.62; AGND -25.4,7.62; AREF -20.32,5.08; GND -27.94,-7.62; GND2 7.62,7.62; GND3 17.78,0; PROG 17.78,2.54; RESET 17.78,5.08; U5V -21.59,-4.445; UD+ -16.51,-4.445; UD- -19.05,-4.445; UGND1 -13.97,-4.445; UGND2 -11.43,-4.445; VBAT 17.78,-5.08; VIN -27.94,7.62; VUSB -25.4,5.08

### Placement (x,y rotation side)
B1  97.79,21.59 180 top
B2  133.03,49.53 180 top
B3  97.79,70.8 180 top
B4  97.79,38.42 180 top
B5  97.79,54.61 180 top
B6  133.03,31.75 0 top
C1  37.78,56.83 270 top
C2  60.96,70.48 270 top
C3  26.67,30.16 90 top
C4  36.83,6.98 90 top
C5  63.5,5.08 0 top
C6  70.8,33.02 90 top
C7  71.44,78.42 0 top
C8  14.29,94.93 90 top
C9  81.6,90.17 90 top
C10  85.72,15.88 90 top
C11  86.68,85.41 0 top
C12  32.7,6.67 90 top
C13  30.48,43.5 90 top
H1  136.35,5 0 top
H2  22,4.36 0 top
H3  22,95.35 0 top
H4  136.66,95.35 0 top
H5  86.67,95.35 0 top
H6  86.35,4.68 0 top
H7  71.68,4.68 0 top
H8  72,95.35 0 top
IC1  49.21,54.93 0 top
IC2  61.91,85.72 0 top
IC3  47.94,19.05 0 top
IC4  45.4,66.99 180 top
IC5  41.59,42.86 0 top
IC6  63.5,18.1 90 top
IC7  69.22,62.55 270 top
IC8  29.53,82.87 0 top
IC9  83.5,77.15 0 top
IC10  24.13,14.61 180 top
IC11  63.5,39.05 90 top
IC12  41.27,30.48 180 top
IC13  48.26,7.3 0 top
J1  131.44,71.44 180 top
J2  86.68,36.2 90 top
J3  22,36.06 90 top
R1  91.76,88.58 90 top
R2  94.3,90.17 90 top
R3  96.84,88.9 90 top
R4  127,89.85 90 top
R5  130.81,89.85 90 top
R6  128.91,88.58 90 top
R7  15.56,49.53 90 top
RGB_LED1  93.98,95.57 90 top
RGB_LED2  129.22,95.57 90 top
S1  133.35,62.23 90 top
U$1  11.43,24.77 90 top
U$2  114.94,33.66 270 top

### Tracks (layer width: path | path; a pad name or v marks a point on that pad's centre or on a via)
3XXX_  (1 unrouted)
9V  (via drill 0.35)
  Top 1.016: v85.72,82.55 v127.64,82.55
  Bottom 1.016: S1.3 130.25,70.03 130.25,73.28 127.64,75.89 v127.64,82.55 | C9.+ 81.6,86.68 v85.72,82.55 80.96,77.79 IC9.1
9V_TO_SW
  Top 1.016: J1.3 128.44,69.99 133.35,65.09 S1.2
37E0RD_  (2 unrouted)
37E0RD_HV_SLLC_  (1 unrouted)
37E0RD_LV_  (1 unrouted)
37E0WR_  (2 unrouted)
37E0WR_LV_  (1 unrouted)
37E0WR_LV_SLLC_  (1 unrouted)
37E4RD_  (2 unrouted)
37E4RD_HV_SLLC_  (1 unrouted)
37E4RD_LV_  (1 unrouted)
37E4WR_  (2 unrouted)
37E4WR_HV_SLLC_  (1 unrouted)
37E4WR_LV_  (1 unrouted)
37E8RD_  (2 unrouted)
37E8RD_HV_SLLC_  (1 unrouted)
37E8RD_LV_  (1 unrouted)
37E8WR_  (2 unrouted)
37E8WR_HV_SLLC_  (1 unrouted)
37E8WR_LV_  (1 unrouted)
37ECRD_  (2 unrouted)
37ECRD_HV_SLLC_  (1 unrouted)
37ECRD_LV_  (1 unrouted)
37ECWR_  (2 unrouted)
37ECWR_HV_SLLC_  (1 unrouted)
37ECWR_LV_  (1 unrouted)
37EX  (1 unrouted)
37EX_  (4 unrouted)
37EXRD  (2 unrouted)
37EXRD_  (2 unrouted)
37EXWR  (2 unrouted)
37EXWR_OUTPUT_ENABLE_  (1 unrouted)
A0_BUFFERED  (2 unrouted)
A0_HV_SLLC  (1 unrouted)
A0_LV  (1 unrouted)
A0_RAW  (1 unrouted)
A1_BUFFERED  (2 unrouted)
A1_HV_SLLC  (1 unrouted)
A1_LV  (1 unrouted)
A1_RAW  (1 unrouted)
A2_BUFFERED  (2 unrouted)
A2_RAW  (1 unrouted)
A3_BUFFERED  (2 unrouted)
A3_RAW  (1 unrouted)
A4_RAW  (1 unrouted)
A5_BUFFERED  (2 unrouted)
A5_RAW  (1 unrouted)
A6_BUFFERED  (2 unrouted)
A6_RAW  (1 unrouted)
A7_BUFFERED  (2 unrouted)
A7_RAW  (1 unrouted)
A8_BUFFERED  (2 unrouted)
A8_RAW  (1 unrouted)
A9_BUFFERED  (2 unrouted)
A9_RAW  (1 unrouted)
A10_BUFFERED  (2 unrouted)
A10_RAW  (1 unrouted)
A11_BUFFERED  (2 unrouted)
A11_RAW  (1 unrouted)
A12_BUFFERED  (2 unrouted)
A12_RAW  (1 unrouted)
A13_BUFFERED  (2 unrouted)
A13_RAW  (1 unrouted)
A14_BUFFERED  (2 unrouted)
A14_RAW  (1 unrouted)
A15_BUFFERED  (2 unrouted)
A15_RAW  (1 unrouted)
BLANK1
  pour Bottom: 0,99.69 11.11,99.69 11.11,85.09 0,85.09
BLANK2
  pour Bottom: 0.32,12.06 0.32,0 11.43,0 11.43,12.06
BLANK3
  pour Top: 0,12.06 0,0 11.75,0 11.43,0.32 11.43,12.06
BLANK4
  pour Top: 0,99.69 0,85.09 11.11,85.09 11.11,99.69
D0  (3 unrouted)
D0_HV  (2 unrouted)
D0_HV_SLLC  (1 unrouted)
D0_LV  (1 unrouted)
D1  (3 unrouted)
D1_HV  (2 unrouted)
D1_HV_SLLC  (1 unrouted)
D1_LV  (1 unrouted)
D2  (3 unrouted)
D2_HV  (2 unrouted)
D2_HV_SLLC  (1 unrouted)
D2_LV  (1 unrouted)
D3  (3 unrouted)
D3_HV  (2 unrouted)
D3_HV_SLLC  (1 unrouted)
D3_LV  (1 unrouted)
D4  (3 unrouted)
D4_HV  (2 unrouted)
D4_HV_SLLC  (1 unrouted)
D4_LV  (1 unrouted)
D5  (3 unrouted)
D5_HV  (2 unrouted)
D5_HV_SLLC  (1 unrouted)
D5_LV  (1 unrouted)
D6  (3 unrouted)
D6_HV  (2 unrouted)
D6_HV_SLLC  (1 unrouted)
D6_LV  (1 unrouted)
D7  (3 unrouted)
D7_HV  (2 unrouted)
D7_HV_SLLC  (1 unrouted)
D7_LV  (1 unrouted)
FLIPFLOP_CLR  (2 unrouted)
FLIPFLOP_CLR_HV_SLLC  (1 unrouted)
FLIPFLOP_CLR_LV  (1 unrouted)
FLIPFLOP_PRE  (2 unrouted)
FLIPFLOP_PRE_HV  (1 unrouted)
FLIPFLOP_PRE_LV  (1 unrouted)
GND  (1 unrouted)
  pour Top: -0.07,100.65 0.36,0.32 141.92,1.19 141.92,99.77
INTERUPT_TO_TRS80_  (2 unrouted)
INTERUPT_TO_TRS80_HV_SLLC_  (1 unrouted)
INTERUPT_TO_TRS80_LV_  (1 unrouted)
N$1  (1 unrouted)
N$2  (1 unrouted)
N$3  (1 unrouted)
N$4  (1 unrouted)
N$5  (1 unrouted)
N$6  (1 unrouted)
N$7  (1 unrouted)
N$8  (1 unrouted)
N$9  (1 unrouted)
N$10  (1 unrouted)
N$11  (1 unrouted)
N$15  (1 unrouted)
N$19  (1 unrouted)
N$20  (1 unrouted)
N$21  (1 unrouted)
NOTHING1_HV_SLLC  (1 unrouted)
NOTHING1_LV  (1 unrouted)
NOTHING2_HV_SLLC  (1 unrouted)
NOTHING2_LV  (1 unrouted)
NOTHING3_HV_SLLC  (1 unrouted)
NOTHING3_LV  (1 unrouted)
RAS  (1 unrouted)
RAS_  (3 unrouted)
RD  (1 unrouted)
RD_  (3 unrouted)
VCC  (1 unrouted)
  pour Bottom: 0,99.69 141.97,99.69 142.4,0.32 0,0.32
VCC/2  (6 unrouted)
WAIT_  (1 unrouted)
WR_  (2 unrouted)
XX11X111111XXXX  (1 unrouted)

### Text on the board
tNames: TRS-80 / SS Drive / V4.1